# Altium schematic sheet IMX8_IO.SchDoc
size 594 x 420 mm; SheetNumber: 6; SheetTotal: 20
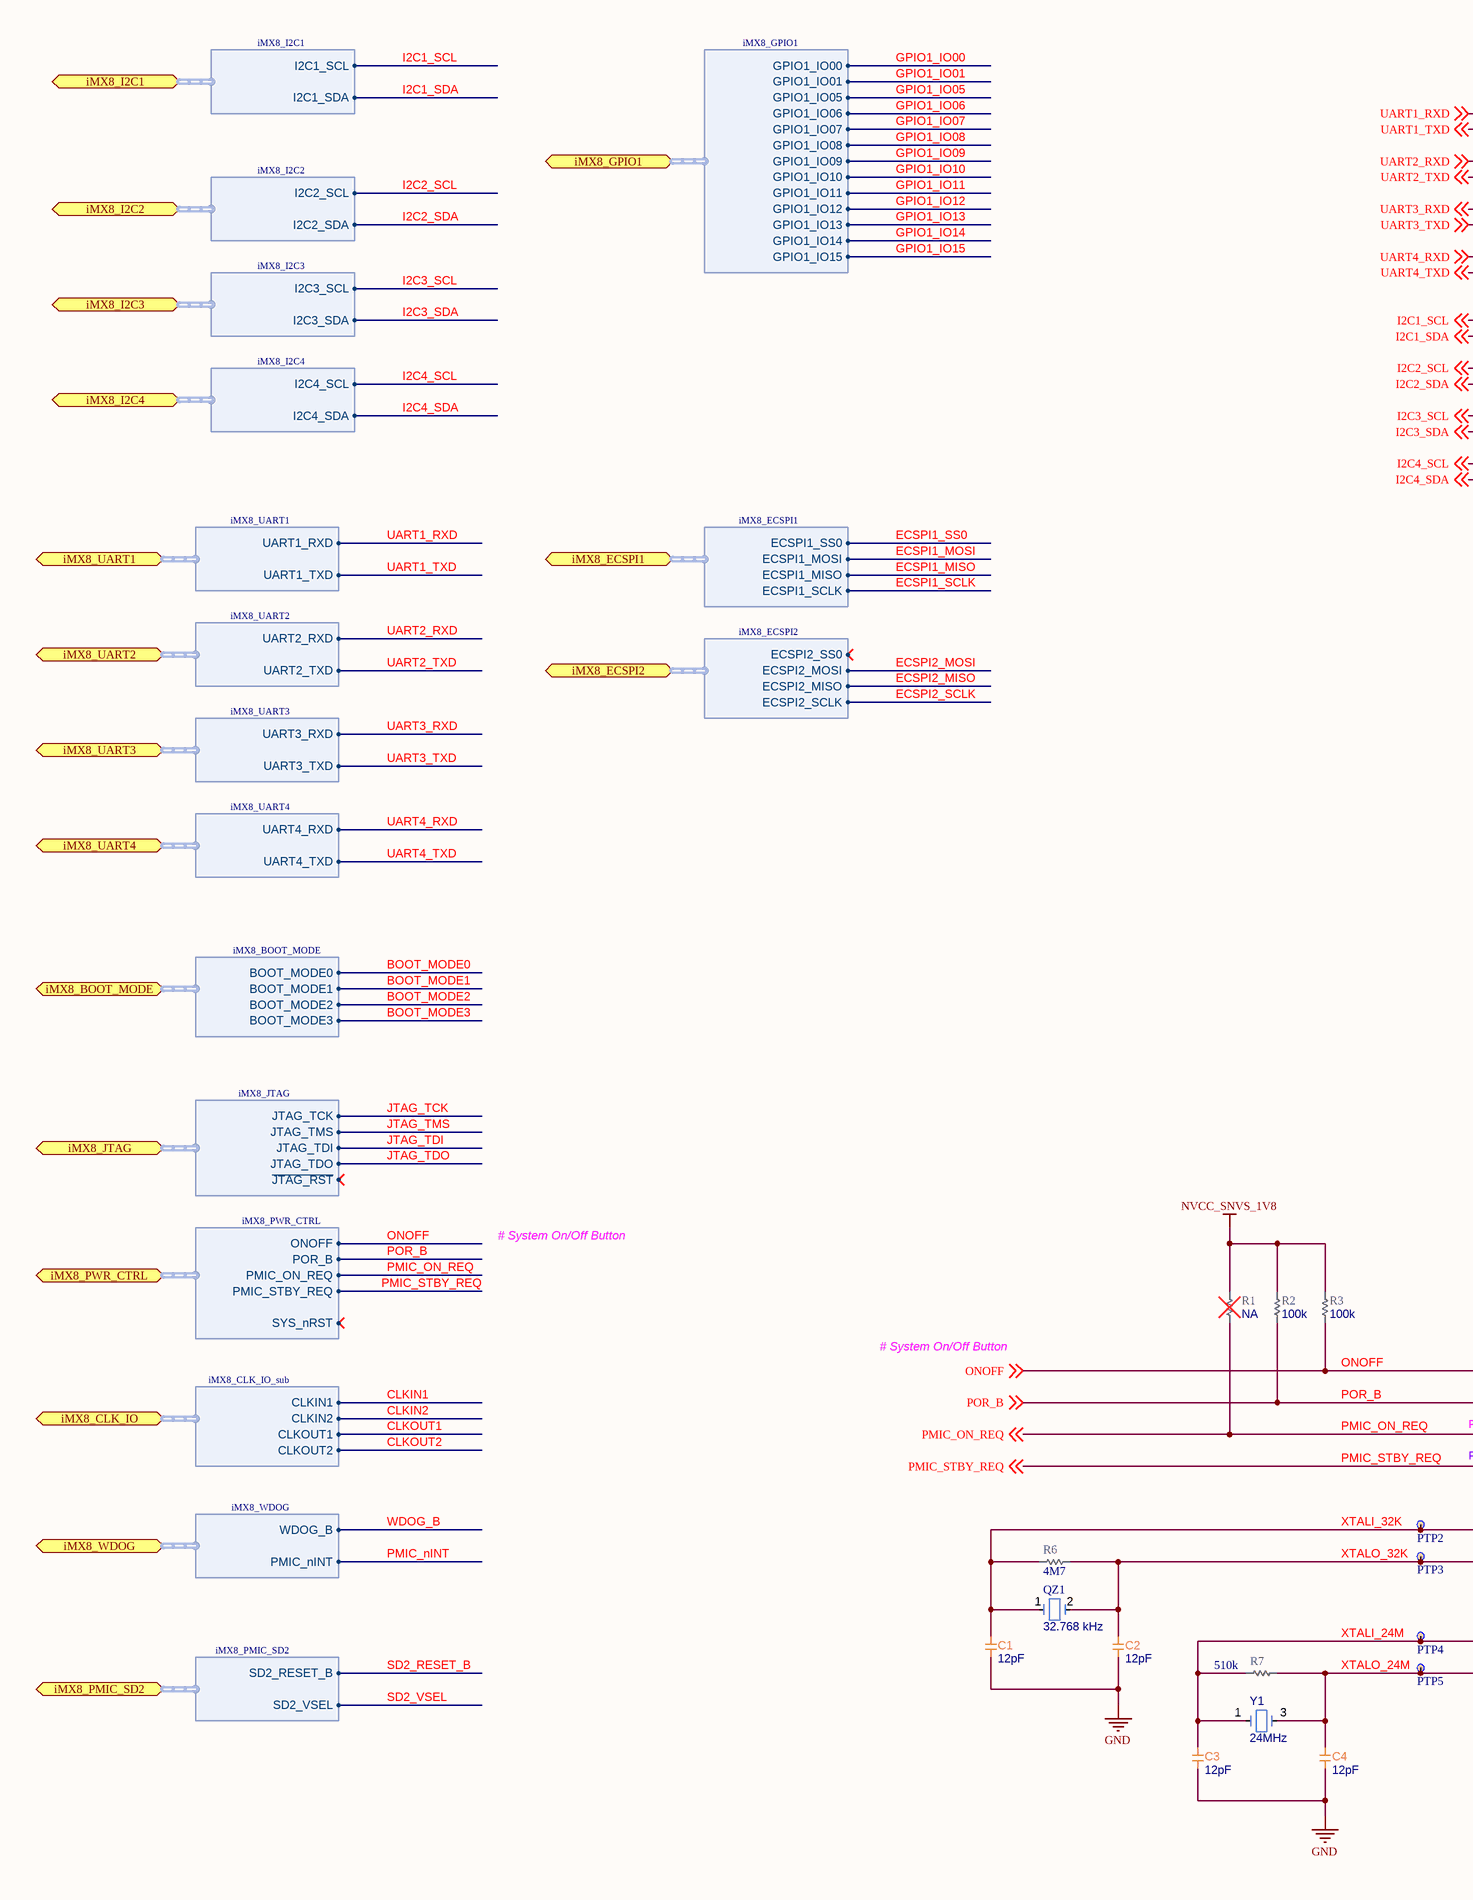
[diagram p0: IMX8_IO.SchDoc, left]
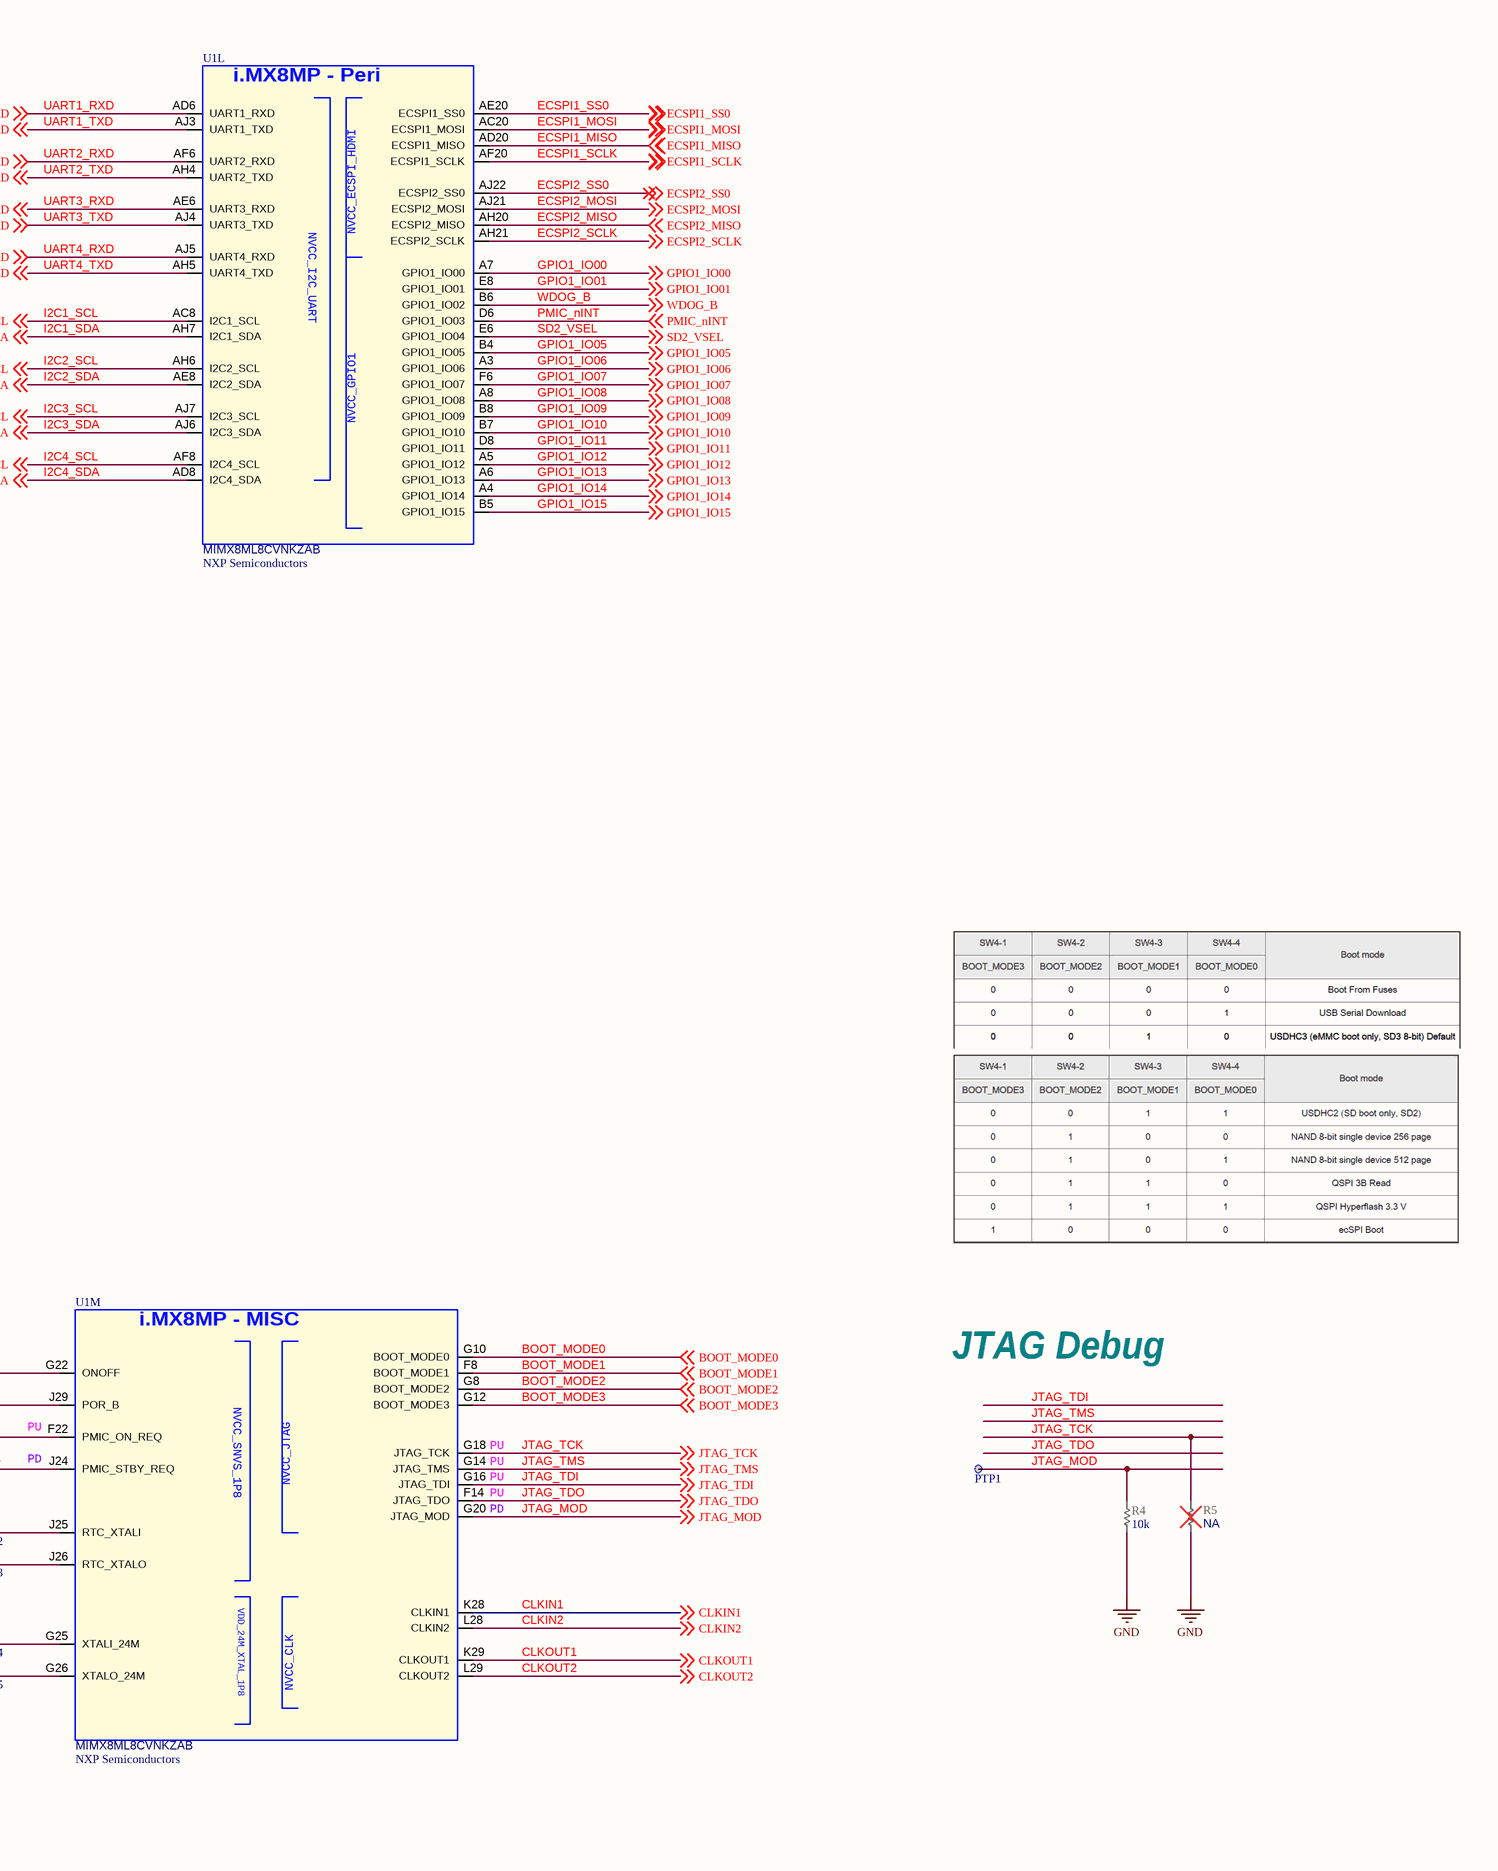
[diagram p1: IMX8_IO.SchDoc, right]

## Parts
C1  value 12pF  [CAP_0201_UN1Q]  (hidden comment: CAP_0201_12pF_RF_MATCHING)
C2  value 12pF  [CAP_0201_UN1Q]  (hidden comment: CAP_0201_12pF_RF_MATCHING)
C3  value 12pF  [CAP_0201_UN1Q]  (hidden comment: CAP_0201_12pF_RF_MATCHING)
C4  value 12pF  [CAP_0201_UN1Q]  (hidden comment: CAP_0201_12pF_RF_MATCHING)
PTP1  PTP_0.4mm  [PTP_0.4mm]  (value not drawn)  (no BOM)
PTP2  PTP_0.4mm  [PTP_0.4mm]  (value not drawn)  (no BOM)
PTP3  PTP_0.4mm  [PTP_0.4mm]  (value not drawn)  (no BOM)
PTP4  PTP_0.4mm  [PTP_0.4mm]  (value not drawn)  (no BOM)
PTP5  PTP_0.4mm  [PTP_0.4mm]  (value not drawn)  (no BOM)
QZ1  value 32.768 kHz  [CM8V32768TA020125_MC]  (hidden comment: XTAL_CM8V-T1A-32_768KHZ-9PF-20PPM-TA-QC)
R1  value NA  [RES_0201_UN1Q]  (hidden comment: RES_0201_NA)
R2  value 100k  [RES_0201_UN1Q]  (hidden comment: RES_0201_100k)
R3  value 100k  [RES_0201_UN1Q]  (hidden comment: RES_0201_100k)
R4  value 10k  [RES_0201_UN1Q]  (hidden comment: RES_0201_10k)
R5  value NA  [RES_0201_UN1Q]  (hidden comment: RES_0201_NA)
R6  value 4M7  [RES_0201_UN1Q]  (hidden comment: RES_0201_4M7)
R7  value 510k  [RES_0201_UN1Q]  (hidden comment: RES_0201_510k)
U1  Manufacturer: NXP Semiconductors  [BGA548C50P29X29_1500X1500X148]  (hidden comment: MIMX8ML8CVNKZAB)  (parts L,M of 15)
Y1  value 24MHz  [XTAL_3225_EPSON]  (hidden comment: XTAL_24M_10ppm_9pF_+105C)

## Ports
iMX8_BOOT_MODE (bidir, harness iMX8_BOOT_MODE), iMX8_CLK_IO (bidir, harness iMX8_CLK_IO_sub), iMX8_ECSPI1 (bidir, harness iMX8_ECSPI1), iMX8_ECSPI2 (bidir, harness iMX8_ECSPI2), iMX8_GPIO1 (bidir, harness iMX8_GPIO1), iMX8_I2C1 (bidir, harness iMX8_I2C1), iMX8_I2C2 (bidir, harness iMX8_I2C2), iMX8_I2C3 (bidir, harness iMX8_I2C3), iMX8_I2C4 (bidir, harness iMX8_I2C4), iMX8_JTAG (bidir, harness iMX8_JTAG), iMX8_PMIC_SD2 (bidir, harness iMX8_PMIC_SD2), iMX8_PWR_CTRL (bidir, harness iMX8_PWR_CTRL), iMX8_UART1 (bidir, harness iMX8_UART1), iMX8_UART2 (bidir, harness iMX8_UART2), iMX8_UART3 (bidir, harness iMX8_UART3), iMX8_UART4 (bidir, harness iMX8_UART4), iMX8_WDOG (bidir, harness iMX8_WDOG)

## Harnesses
iMX8_JTAG: JTAG_TCK, JTAG_TMS, JTAG_TDI, JTAG_TDO, ~{JTAG_RST}
iMX8_CLK_IO_sub: CLKIN1, CLKIN2, CLKOUT1, CLKOUT2
iMX8_PWR_CTRL: ONOFF, POR_B, PMIC_ON_REQ, PMIC_STBY_REQ, SYS_nRST
iMX8_I2C1: I2C1_SCL, I2C1_SDA
iMX8_I2C2: I2C2_SCL, I2C2_SDA
iMX8_I2C3: I2C3_SCL, I2C3_SDA
iMX8_I2C4: I2C4_SCL, I2C4_SDA
iMX8_UART1: UART1_RXD, UART1_TXD
iMX8_UART2: UART2_RXD, UART2_TXD
iMX8_UART3: UART3_RXD, UART3_TXD
iMX8_UART4: UART4_RXD, UART4_TXD
iMX8_GPIO1: GPIO1_IO00, GPIO1_IO01, GPIO1_IO05, GPIO1_IO06, GPIO1_IO07, GPIO1_IO08, GPIO1_IO09, GPIO1_IO10, GPIO1_IO11, GPIO1_IO12, GPIO1_IO13, GPIO1_IO14, GPIO1_IO15
iMX8_ECSPI1: ECSPI1_SS0, ECSPI1_MOSI, ECSPI1_MISO, ECSPI1_SCLK
iMX8_WDOG: WDOG_B, PMIC_nINT
iMX8_PMIC_SD2: SD2_RESET_B, SD2_VSEL
iMX8_ECSPI2: ECSPI2_SS0, ECSPI2_MOSI, ECSPI2_MISO, ECSPI2_SCLK
iMX8_BOOT_MODE: BOOT_MODE0, BOOT_MODE1, BOOT_MODE2, BOOT_MODE3

## Nets
GND: C1.1 C2.2 C3.2 C4.2 R4.2 R5.2 Y1.2(GND) Y1.4(GND)
NVCC_SNVS_1V8: R1.1 R2.1 R3.1
BOOT_MODE0: U1.G10(BOOT_MODE0) ; off-sheet BOOT_MODE0, port iMX8_BOOT_MODE.BOOT_MODE0
BOOT_MODE1: U1.F8(BOOT_MODE1) ; off-sheet BOOT_MODE1, port iMX8_BOOT_MODE.BOOT_MODE1
BOOT_MODE2: U1.G8(BOOT_MODE2) ; off-sheet BOOT_MODE2, port iMX8_BOOT_MODE.BOOT_MODE2
BOOT_MODE3: U1.G12(BOOT_MODE3) ; off-sheet BOOT_MODE3, port iMX8_BOOT_MODE.BOOT_MODE3
CLKIN1: U1.K28(CLKIN1) ; off-sheet CLKIN1, port iMX8_CLK_IO.CLKIN1
CLKIN2: U1.L28(CLKIN2) ; off-sheet CLKIN2, port iMX8_CLK_IO.CLKIN2
CLKOUT1: U1.K29(CLKOUT1) ; off-sheet CLKOUT1, port iMX8_CLK_IO.CLKOUT1
CLKOUT2: U1.L29(CLKOUT2) ; off-sheet CLKOUT2, port iMX8_CLK_IO.CLKOUT2
ECSPI1_MISO: U1.AD20(ECSPI1_MISO) ; off-sheet ECSPI1_MISO, port iMX8_ECSPI1.ECSPI1_MISO
ECSPI1_MOSI: U1.AC20(ECSPI1_MOSI) ; off-sheet ECSPI1_MOSI, port iMX8_ECSPI1.ECSPI1_MOSI
ECSPI1_SCLK: U1.AF20(ECSPI1_SCLK) ; off-sheet ECSPI1_SCLK, port iMX8_ECSPI1.ECSPI1_SCLK
ECSPI1_SS0: U1.AE20(ECSPI1_SS0) ; off-sheet ECSPI1_SS0, port iMX8_ECSPI1.ECSPI1_SS0
ECSPI2_MISO: U1.AH20(ECSPI2_MISO) ; off-sheet ECSPI2_MISO, port iMX8_ECSPI2.ECSPI2_MISO
ECSPI2_MOSI: U1.AJ21(ECSPI2_MOSI) ; off-sheet ECSPI2_MOSI, port iMX8_ECSPI2.ECSPI2_MOSI
ECSPI2_SCLK: U1.AH21(ECSPI2_SCLK) ; off-sheet ECSPI2_SCLK, port iMX8_ECSPI2.ECSPI2_SCLK
ECSPI2_SS0: U1.AJ22(ECSPI2_SS0) ; off-sheet ECSPI2_SS0
GPIO1_IO00: U1.A7(GPIO1_IO00) ; off-sheet GPIO1_IO00, port iMX8_GPIO1.GPIO1_IO00
GPIO1_IO01: U1.E8(GPIO1_IO01) ; off-sheet GPIO1_IO01, port iMX8_GPIO1.GPIO1_IO01
GPIO1_IO05: U1.B4(GPIO1_IO05) ; off-sheet GPIO1_IO05, port iMX8_GPIO1.GPIO1_IO05
GPIO1_IO06: U1.A3(GPIO1_IO06) ; off-sheet GPIO1_IO06, port iMX8_GPIO1.GPIO1_IO06
GPIO1_IO07: U1.F6(GPIO1_IO07) ; off-sheet GPIO1_IO07, port iMX8_GPIO1.GPIO1_IO07
GPIO1_IO08: U1.A8(GPIO1_IO08) ; off-sheet GPIO1_IO08, port iMX8_GPIO1.GPIO1_IO08
GPIO1_IO09: U1.B8(GPIO1_IO09) ; off-sheet GPIO1_IO09, port iMX8_GPIO1.GPIO1_IO09
GPIO1_IO10: U1.B7(GPIO1_IO10) ; off-sheet GPIO1_IO10, port iMX8_GPIO1.GPIO1_IO10
GPIO1_IO11: U1.D8(GPIO1_IO11) ; off-sheet GPIO1_IO11, port iMX8_GPIO1.GPIO1_IO11
GPIO1_IO12: U1.A5(GPIO1_IO12) ; off-sheet GPIO1_IO12, port iMX8_GPIO1.GPIO1_IO12
GPIO1_IO13: U1.A6(GPIO1_IO13) ; off-sheet GPIO1_IO13, port iMX8_GPIO1.GPIO1_IO13
GPIO1_IO14: U1.A4(GPIO1_IO14) ; off-sheet GPIO1_IO14, port iMX8_GPIO1.GPIO1_IO14
GPIO1_IO15: U1.B5(GPIO1_IO15) ; off-sheet GPIO1_IO15, port iMX8_GPIO1.GPIO1_IO15
I2C1_SCL: U1.AC8(I2C1_SCL) ; off-sheet I2C1_SCL, port iMX8_I2C1.I2C1_SCL
I2C1_SDA: U1.AH7(I2C1_SDA) ; off-sheet I2C1_SDA, port iMX8_I2C1.I2C1_SDA
I2C2_SCL: U1.AH6(I2C2_SCL) ; off-sheet I2C2_SCL, port iMX8_I2C2.I2C2_SCL
I2C2_SDA: U1.AE8(I2C2_SDA) ; off-sheet I2C2_SDA, port iMX8_I2C2.I2C2_SDA
I2C3_SCL: U1.AJ7(I2C3_SCL) ; off-sheet I2C3_SCL, port iMX8_I2C3.I2C3_SCL
I2C3_SDA: U1.AJ6(I2C3_SDA) ; off-sheet I2C3_SDA, port iMX8_I2C3.I2C3_SDA
I2C4_SCL: U1.AF8(I2C4_SCL) ; off-sheet I2C4_SCL, port iMX8_I2C4.I2C4_SCL
I2C4_SDA: U1.AD8(I2C4_SDA) ; off-sheet I2C4_SDA, port iMX8_I2C4.I2C4_SDA
JTAG_MOD: PTP1.1(TP) R4.1 U1.G20(JTAG_MOD) ; off-sheet JTAG_MOD
JTAG_TCK: R5.1 U1.G18(JTAG_TCK) ; off-sheet JTAG_TCK, port iMX8_JTAG.JTAG_TCK
JTAG_TDI: U1.G16(JTAG_TDI) ; off-sheet JTAG_TDI, port iMX8_JTAG.JTAG_TDI
JTAG_TDO: U1.F14(JTAG_TDO) ; off-sheet JTAG_TDO, port iMX8_JTAG.JTAG_TDO
JTAG_TMS: U1.G14(JTAG_TMS) ; off-sheet JTAG_TMS, port iMX8_JTAG.JTAG_TMS
ONOFF: R3.2 U1.G22(ONOFF) ; off-sheet ONOFF, port iMX8_PWR_CTRL.ONOFF
PMIC_nINT: U1.D6(GPIO1_IO03) ; off-sheet PMIC_nINT, port iMX8_WDOG.PMIC_nINT
PMIC_ON_REQ: R1.2 U1.F22(PMIC_ON_REQ) ; off-sheet PMIC_ON_REQ, port iMX8_PWR_CTRL.PMIC_ON_REQ
PMIC_STBY_REQ: U1.J24(PMIC_STBY_REQ) ; off-sheet PMIC_STBY_REQ, port iMX8_PWR_CTRL.PMIC_STBY_REQ
POR_B: R2.2 U1.J29(POR_B) ; off-sheet POR_B, port iMX8_PWR_CTRL.POR_B
SD2_RESET_B: port iMX8_PMIC_SD2.SD2_RESET_B
SD2_VSEL: U1.E6(GPIO1_IO04) ; off-sheet SD2_VSEL, port iMX8_PMIC_SD2.SD2_VSEL
UART1_RXD: U1.AD6(UART1_RXD) ; off-sheet UART1_RXD, port iMX8_UART1.UART1_RXD
UART1_TXD: U1.AJ3(UART1_TXD) ; off-sheet UART1_TXD, port iMX8_UART1.UART1_TXD
UART2_RXD: U1.AF6(UART2_RXD) ; off-sheet UART2_RXD, port iMX8_UART2.UART2_RXD
UART2_TXD: U1.AH4(UART2_TXD) ; off-sheet UART2_TXD, port iMX8_UART2.UART2_TXD
UART3_RXD: U1.AE6(UART3_RXD) ; off-sheet UART3_RXD, port iMX8_UART3.UART3_RXD
UART3_TXD: U1.AJ4(UART3_TXD) ; off-sheet UART3_TXD, port iMX8_UART3.UART3_TXD
UART4_RXD: U1.AJ5(UART4_RXD) ; off-sheet UART4_RXD, port iMX8_UART4.UART4_RXD
UART4_TXD: U1.AH5(UART4_TXD) ; off-sheet UART4_TXD, port iMX8_UART4.UART4_TXD
WDOG_B: U1.B6(GPIO1_IO02) ; off-sheet WDOG_B, port iMX8_WDOG.WDOG_B
XTALI_24M: C3.1 PTP4.1(TP) R7.1 U1.G25(XTALI_24M) Y1.1
XTALI_32K: C1.2 PTP2.1(TP) QZ1.1 R6.1 U1.J25(RTC_XTALI)
XTALO_24M: C4.1 PTP5.1(TP) R7.2 U1.G26(XTALO_24M) Y1.3
XTALO_32K: C2.1 PTP3.1(TP) QZ1.2 R6.2 U1.J26(RTC_XTALO)

## Notes on the sheet
- # System On/Off Button
- JTAG Debug
- (near U1) PD
- (near U1) PU
- DWG NO:
- REV:
- THIS DOCUMENT AND THE DATA DISCLOSED HEREIN OR
- HEREWITH IS THE PROPERTY OF ALTIUM LIMITED AND MAY
- BE FREELY DISTRIBUTED IN WHOLE. NO RIGHTS ARE
- RESERVED OR EXPRESS OR IMPLIED WARANTEE GIVEN.
- REVISION
- DESCRIPTION
- DATE
- APPROVED
- ENG:
- APPROVALS
- PROJECT
- DSN:
- CHK:
- REFERENCE DOCUMENTS
- PROJECT REVISION:
- TITLE
- DOCUMENT REVISION:
- DESIGN ITEM:
- BOM:
- FAB DWG:
- PCB DWG:
- ASSY DWG:
- SCALE:
- A2
- SIZE
- CAGE CODE
- FILE NAME
- DWG NO.
- SHEET
- OF
- REV
- (in symbol CMP-001-000983-8, part L) i.MX8MP - Peri; NVCC_GPIO1
- (in symbol CMP-001-000983-8, part M) i.MX8MP - MISC

## Library data of the parts
C1-C4 = CMP-001-000420-11: CAP_RF_MATCHING; Part Number: GRM0335C1H120GA01; Manufacturer: Murata; Voltage: 50V; Tolerance: +/- 2%; Temperature characteristics: C0G; Remark: RF matching, use part number; Sort order: 202; HasBeenBuilt: TBD; System: RLC; Package: 0201; Operating temperature range: -55 ... +125C; ComponentLink1Description: 1_Datasheet; ComponentLink2Description: 2_Product page; ComponentLink3Description: 3_X-information; ComponentLink4Description: 4_X-information; Creation date: 20211123; ClassName: SMALL; Source: RLC_UN1Q.SchLib; Manufacturer Part Number: GRM0335C1H120GA01; Component Type: Capacitor
PTP1-PTP5 = CMP-001-001296-3: Production Testpoint 0.4mm. Flying probe. Use 1mm pitch.; Part Number: PTP 0.4mm; ComponentLink4Description: 4_X-information; ComponentLink1Description: 1_Datasheet; Sort order: -; ClassName: SMALL; System: Test Point; HasBeenBuilt: -; Design Item ID: PTP_0.4mm; ComponentLink3Description: 3_X-information; Creation date: 20240909; ComponentLink2Description: 2_Product page; Component Type: Test Point
QZ1 = CMP-001-000697-8: SMT Quartz Crystal; Manufacturer: Micro Crystal; Part Number: CM8V-T1A-32.768KHZ-9PF-20PPM-TA-QC; HasBeenBuilt: SleeveIO_01; Sort order: 455; System: Discrete; ClassName: BIG; ComponentLink1Description: 1_Datasheet; ComponentLink1URL: https://www.microcrystal.com/fileadmin/Media/Products/32kHz/Datasheet/CM8V-T1A.pdf; ComponentLink2Description: 2_Product page; ComponentLink2URL: https://www.microcrystal.com/en/products/khz-quartz-crystals/cm8v-t1a/; ComponentLink3Description: 3_X-information; ComponentLink4Description: 4_X-information; Creation date: 20210913; Dimensions WxLxH: 1.2x2.0x0.6mm; Operating temperature range: -40 .... +85 °C; Package: 2-SMD; Source: Discrete_UN1Q.SchLib; Manufacturer Part Number: CM8V-T1A-32.768KHZ-9PF-20PPM-TA-QC; Component Type: Crystal & Oscillator
R1 R5 = CMP-001-000434-10: Not Assembled - RES; Sort order: 999; HasBeenBuilt: TBD; System: RLC; Package: 0201; ClassName: SMALL; ComponentLink1Description: 1_Datasheet; ComponentLink2Description: 2_Product page; ComponentLink3Description: 3_X-information; ComponentLink4Description: 4_X-information; Creation date: 20190101; Source: RLC_UN1Q.SchLib; Component Type: Resistor
R2 R3 = CMP-001-000526-11: RES; Part Number: RC0201FR-07100KL; Manufacturer: YAGEO; Tolerance: 1%; Power Rating: 1/20W; Sort order: 322; HasBeenBuilt: TBD; Alternative component: Allowed; System: RLC; Package: 0201; ClassName: SMALL; ComponentLink1Description: 1_Datasheet; ComponentLink2Description: 2_Product page; ComponentLink3Description: 3_X-information; ComponentLink4Description: 4_X-information; Creation date: 20190101; Source: RLC_UN1Q.SchLib; Component Type: Resistor
R4 = CMP-001-000446-13: RES; Part Number: RC0201FR-0710KL; Manufacturer: YAGEO; Power Rating: 1/20W; Sort order: 322; HasBeenBuilt: TBD; Tolerance: 1%; Alternative component: Allowed; System: RLC; Package: 0201; ClassName: SMALL; ComponentLink1Description: 1_Datasheet; ComponentLink2Description: 2_Product page; ComponentLink3Description: 3_X-information; ComponentLink4Description: 4_X-information; Creation date: 20190101; Source: RLC_UN1Q.SchLib; Component Type: Resistor
R6 = CMP-001-001254-9: RES; Part Number: MCRE000254; Manufacturer: MULTICOMP PRO; Tolerance: 1%; Power Rating: 1/20W; Sort order: 322; Alternative component: Allowed; System: RLC; Package: 0201; ClassName: SMALL; ComponentLink1Description: 1_Datasheet; ComponentLink2Description: 2_Product page; ComponentLink3Description: 3_X-information; ComponentLink4Description: 4_X-information; Creation date: 20240404; Component Type: Resistor
R7 = CMP-001-000576-12: RES; Part Number: ERJ-1GNF5103C; Manufacturer: Panasonic Electronic Components; Sort order: 322; HasBeenBuilt: TBD; Alternative component: Allowed; System: RLC; Power Rating: 1/20W; Tolerance: 1%; Package: 0201; ComponentLink1Description: 1_Datasheet; ComponentLink2Description: 2_Product page; ComponentLink3Description: 3_X-information; ComponentLink4Description: 4_X-information; Creation date: 20211123; Source: RLC_UN1Q.SchLib; ClassName: SMALL; Component Type: Resistor
U1 = CMP-001-000983-8: CPU QUAD CORTEX A53+M4 1.6GHZ BGA548 Industrial; Sort order: 501; System: IC; ComponentLink1Description: 1_Datasheet; ComponentLink1URL: https://www.nxp.com/part/MIMX8ML8CVNKZAB#/; ComponentLink2Description: 2_Product page; ComponentLink3Description: 3_X-information; ComponentLink4Description: 4_X-information; Creation date: 20240524; Dimensions WxLxH: 15 x 15 x 1.33mm; Manufacturer: NXP SEMICONDUCTORS; Operating temperature range: -40... +105 °C; Package: FCBGA548; Part Number: MIMX8ML8CVNKZAB; ClassName: BIG; Source: UUDET_KOMPONENTIT.SchLib; Design Item ID: MIMX8ML8CVNKZAB; Manufacturer Part Number: MIMX8ML8CVNKZAB; Component Type: Processor
Y1 = CMP-001-001243-5: Crystal 24 MHz ±10ppm 9pF 40Ohms 4-SMD; Part Number: TSX-3225 24.0000MF20G-AC3; Manufacturer: EPSON; Tolerance: +/-10ppm; Sort order: 455; System: Discrete; Operating temperature range: -40 ... +105C; Dimensions WxLxH: 3.2 x 2.5 x 0.6mm; ComponentLink1Description: 1_Datasheet; ComponentLink1URL: https://support.epson.biz/td/api/doc_check.php?dl=brief_TSX-3225&lang=en; ComponentLink2Description: 2_Product page; ComponentLink3Description: 3_X-information; ComponentLink4Description: 4_X-information; Creation date: 20240430; Manufacturer: Epson; Manufacturer Part Number: TSX-3225 24.0000MF20G-AC3; Component Type: Crystal & Oscillator